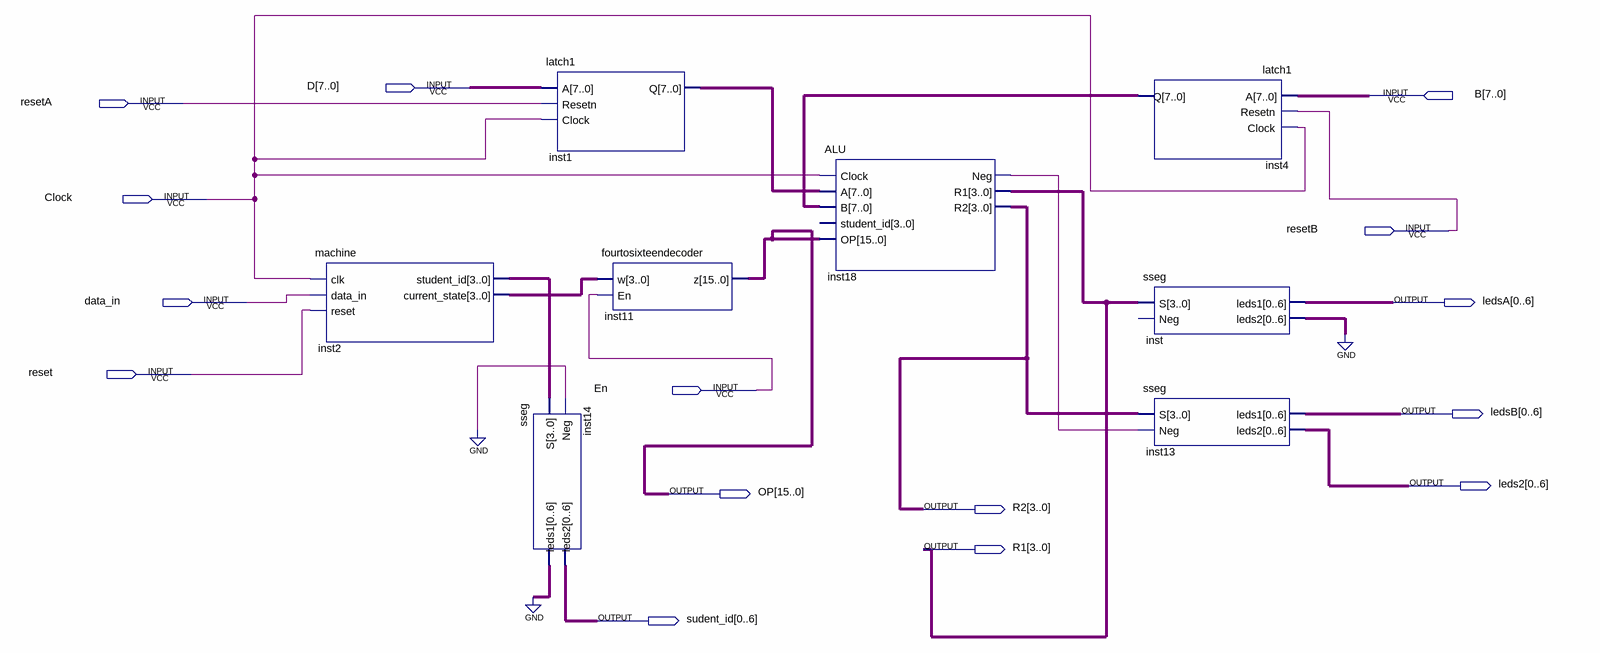
[diagram p0: schematic sheet]
// Quartus schematic lab6blockdiagram.bdf as structural Verilog: 8 symbols, 15 pins
module lab6blockdiagram (
  input  [7:0] D,
  input  [7:0] B,
  input  resetA,
  input  Clock,
  input  resetB,
  input  data_in,
  input  reset,
  input  En,
  output [0:6] ledsA,
  output [0:6] ledsB,
  output [0:6] leds2,
  output [15:0] OP,
  output [3:0] R2,
  output [3:0] R1,
  output [0:6] sudent_id
);

  wire inst18_neg;
  wire [3:0] inst2_current_state, inst2_student_id;
  wire [6:0] inst14_leds1, inst_leds2;
  wire [7:0] inst1_q, inst4_q;

  machine inst2 (
    .clk(Clock), .data_in(data_in), .reset(reset), .student_id(inst2_student_id),
    .current_state(inst2_current_state));
  sseg inst14 (.S(inst2_student_id), .Neg(1'b0), .leds1(inst14_leds1), .leds2(sudent_id));
  latch1 inst1 (.A(D), .Resetn(resetA), .Clock(Clock), .Q(inst1_q));
  fourtosixteendecoder inst11 (.w(inst2_current_state), .En(En), .z(OP));
  ALU inst18 (
    .Clock(Clock), .A(inst1_q), .B(inst4_q), .OP(OP), .Neg(inst18_neg), .R1(R1), .R2(R2));  // open: student_id
  latch1 inst4 (.A(B), .Resetn(resetB), .Clock(Clock), .Q(inst4_q));
  sseg inst (.S(R1), .leds1(ledsA), .leds2(inst_leds2));  // open: Neg
  sseg inst13 (.S(R2), .Neg(inst18_neg), .leds1(ledsB), .leds2(leds2));
  // also tied to GND on the sheet: {inst_leds2[0], inst_leds2[1], inst_leds2[2], inst_leds2[3], inst_leds2[4], inst_leds2[5], inst_leds2[6], inst14_leds1[0], inst14_leds1[1], inst14_leds1[2], inst14_leds1[3], inst14_leds1[4], inst14_leds1[5], inst14_leds1[6]}
endmodule
